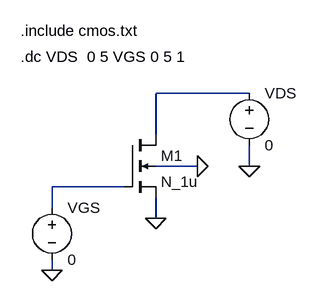
[diagram p0: schematic tranzystor.asc]
tranzystor.asc, the LTspice schematic file:
Version 4
SHEET 1 880 680
WIRE 384 64 240 64
WIRE 240 128 240 64
WIRE 304 176 240 176
WIRE 384 176 384 144
WIRE 192 208 80 208
WIRE 80 240 80 208
WIRE 240 256 240 224
WIRE 80 336 80 320
FLAG 304 176 0
FLAG 240 256 0
FLAG 384 176 0
FLAG 80 336 0
SYMBOL nmos4 192 128 R0
SYMATTR InstName M1
SYMATTR Value N_1u
SYMATTR Value2 l=1u w=10u
SYMBOL voltage 384 48 R0
WINDOW 123 0 0 Left 0
WINDOW 39 0 0 Left 0
SYMATTR InstName VDS
SYMATTR Value 0
SYMBOL voltage 80 224 R0
WINDOW 123 0 0 Left 0
WINDOW 39 0 0 Left 0
SYMATTR InstName VGS
SYMATTR Value 0
TEXT 32 -32 Left 2 !.include cmos.txt
TEXT 32 8 Left 2 !.dc VDS  0 5 VGS 0 5 1

The netlist it stands for:
* tranzystor.asc
M1 N001 N002 0 0 N_1u l=1u w=10u
VDS N001 0 0
VGS N002 0 0
.model NMOS NMOS
.model PMOS PMOS
.lib standard.mos
.include cmos.txt
.dc VDS  0 5 VGS 0 5 1
.backanno
.end